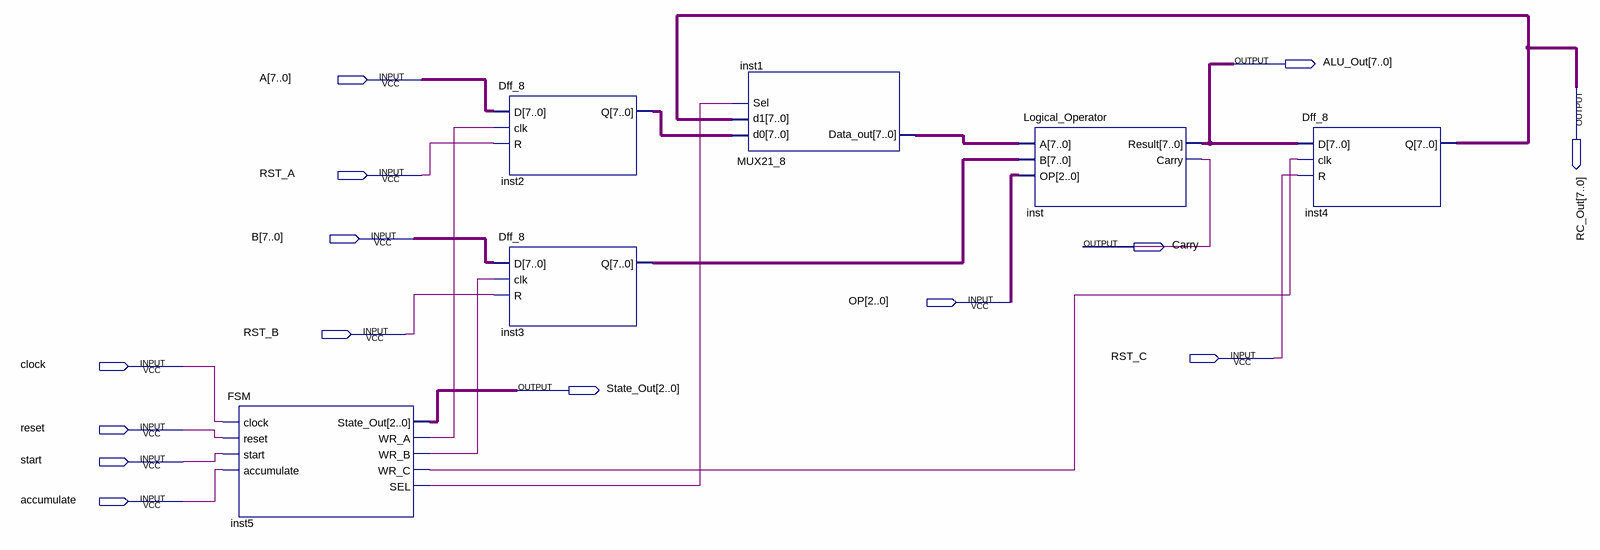
[diagram p0: schematic sheet]
// Quartus schematic Final_Project_ALU.bdf as structural Verilog: 6 symbols, 14 pins
module Final_Project_ALU (
  input  [7:0] A,
  input  RST_A,
  input  [7:0] B,
  input  [2:0] OP,
  input  RST_B,
  input  RST_C,
  input  clock,
  input  reset,
  input  start,
  input  accumulate,
  output [7:0] ALU_Out,
  output [7:0] RC_Out,
  output Carry,
  output [2:0] State_Out
);

  wire inst5_sel, inst5_wr_a, inst5_wr_b, inst5_wr_c;
  wire [7:0] inst1_data_out, inst2_q, inst3_q;

  FSM inst5 (
    .clock(clock), .reset(reset), .start(start), .accumulate(accumulate), .State_Out(State_Out),
    .WR_A(inst5_wr_a), .WR_B(inst5_wr_b), .WR_C(inst5_wr_c), .SEL(inst5_sel));
  Dff_8 inst2 (.D(A), .clk(inst5_wr_a), .R(RST_A), .Q(inst2_q));
  Dff_8 inst3 (.D(B), .clk(inst5_wr_b), .R(RST_B), .Q(inst3_q));
  MUX21_8 inst1 (.d0(inst2_q), .d1(RC_Out), .Sel(inst5_sel), .Data_out(inst1_data_out));
  Logical_Operator inst (.A(inst1_data_out), .B(inst3_q), .OP(OP), .Result(ALU_Out), .Carry(Carry));
  Dff_8 inst4 (.D(ALU_Out), .clk(inst5_wr_c), .R(RST_C), .Q(RC_Out));
endmodule
